# EasyEDA schematic motion sensor2.json
TITLE: Sheet_1; REV: 1.0; Date: 2024-07-08; Sheet: 1/1; Company: Your Company
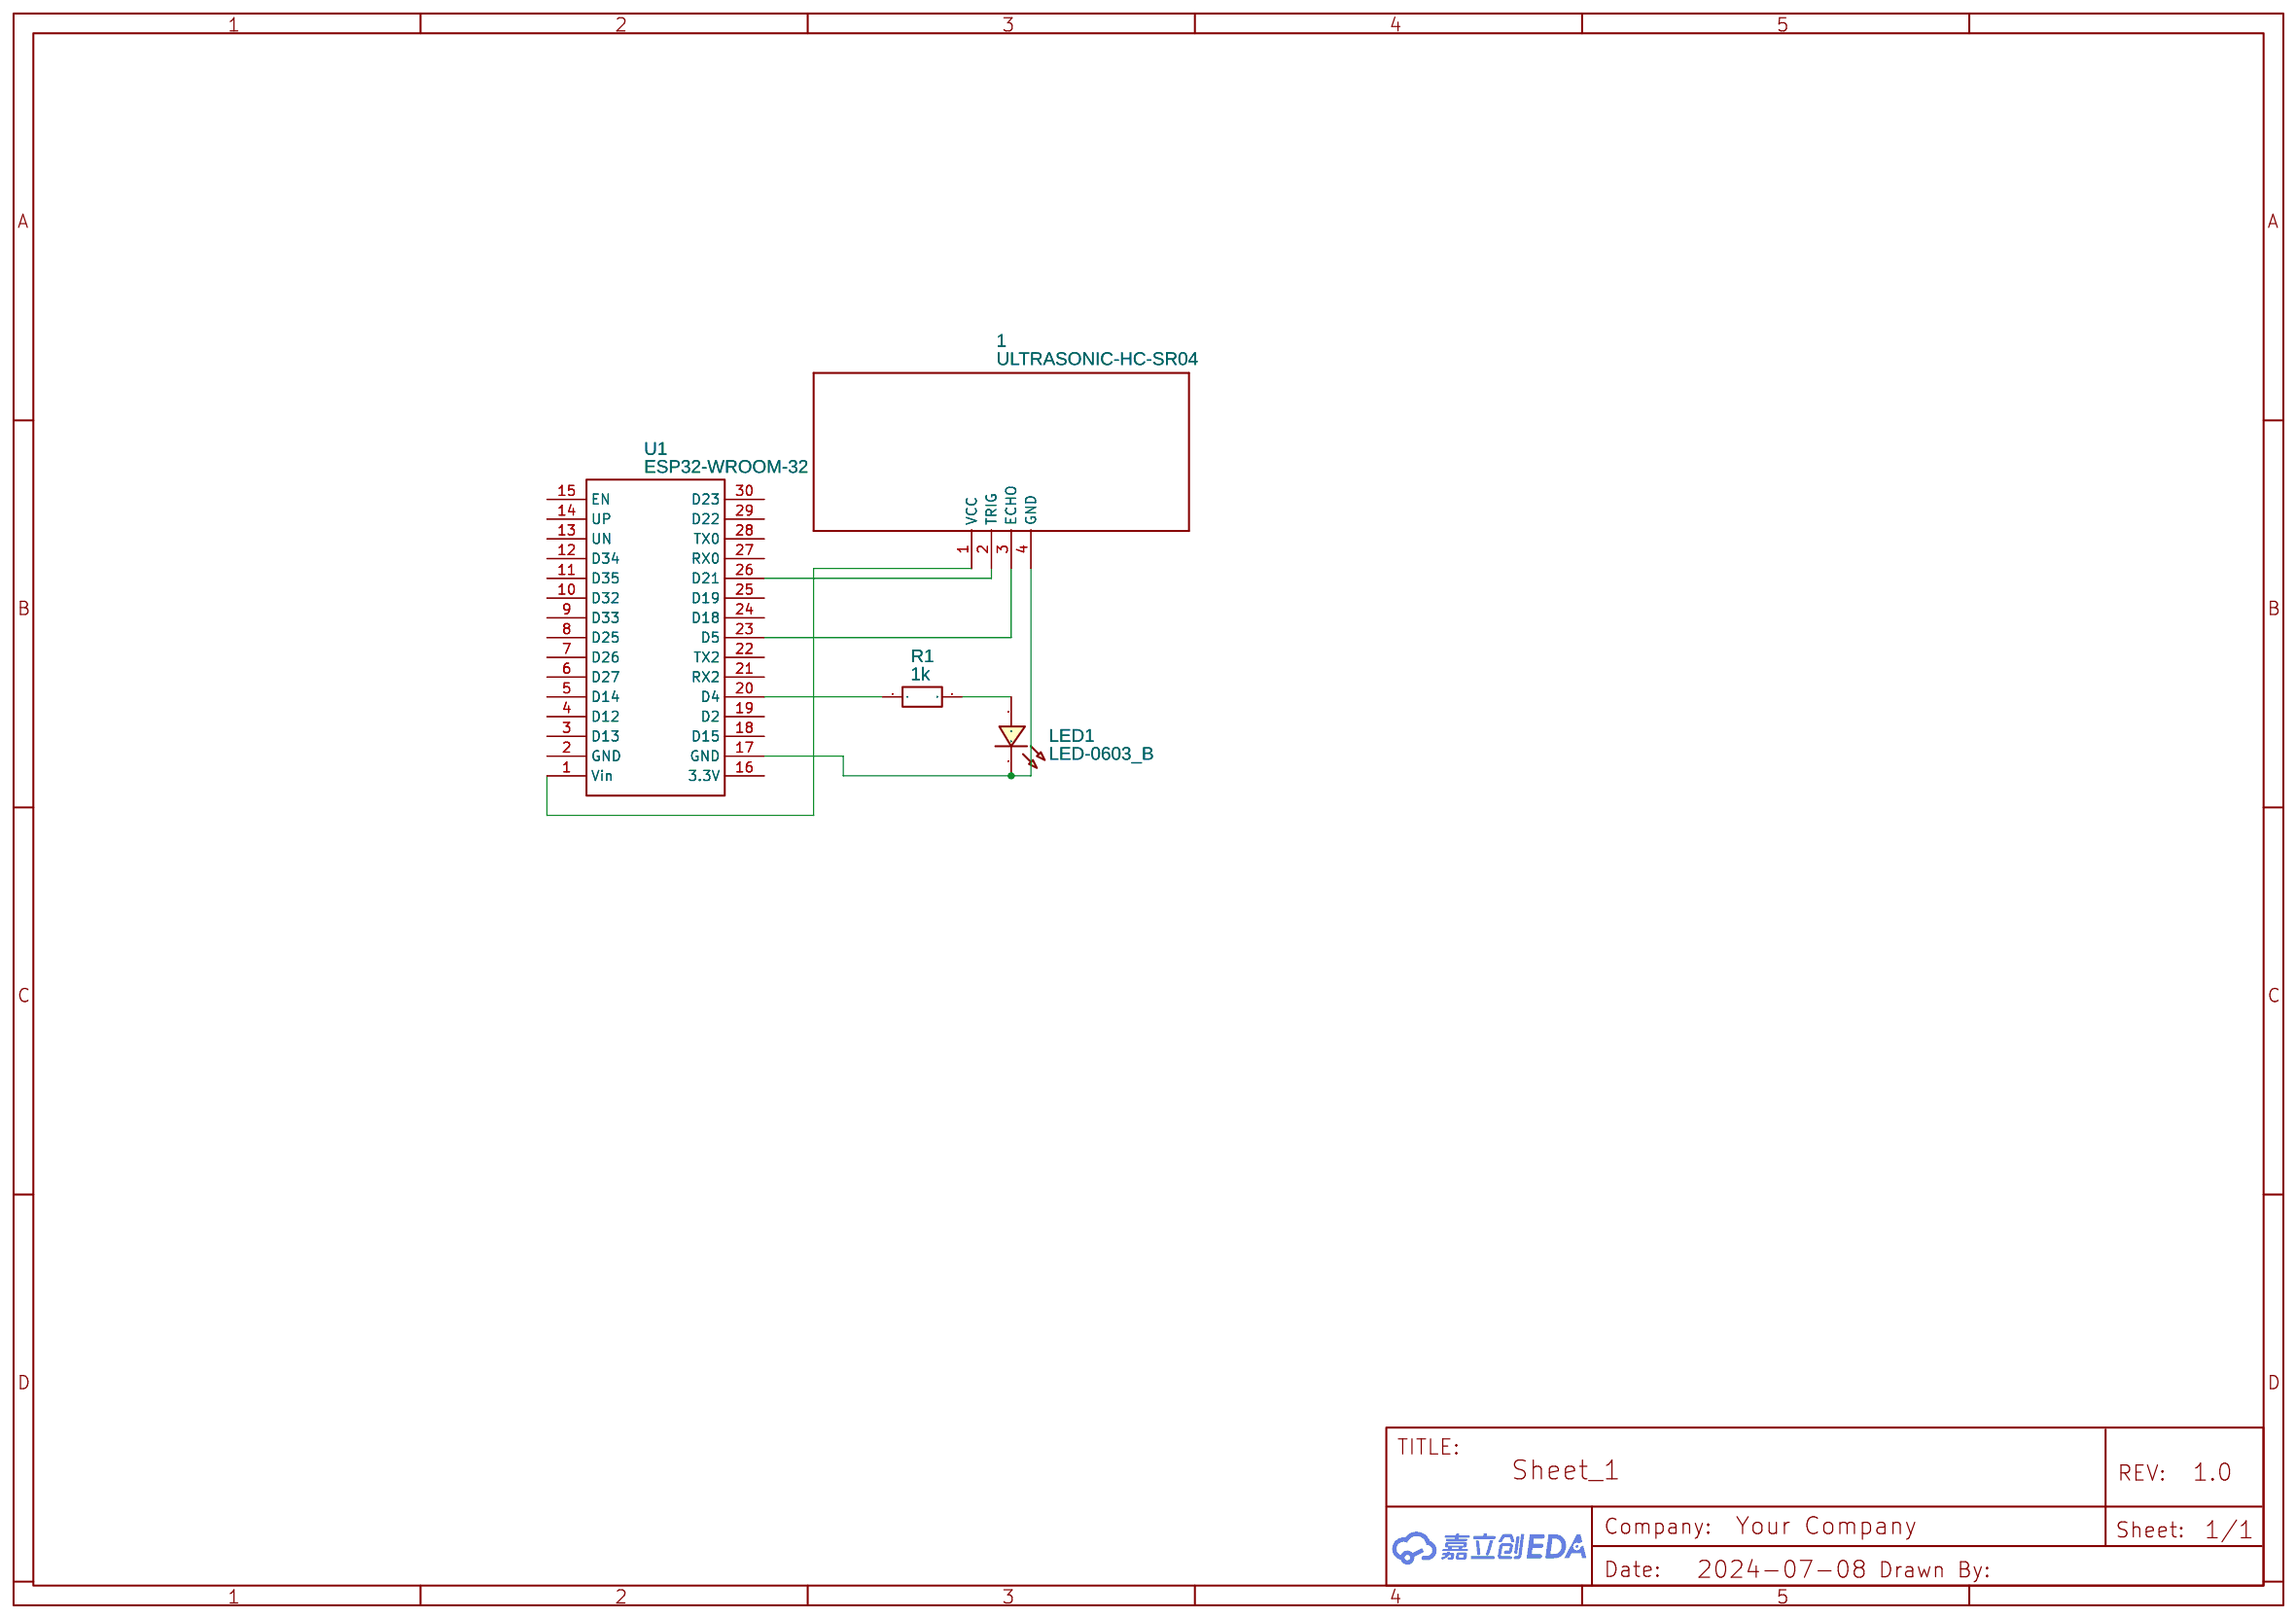
[diagram p0: schematic sheet]

## Parts
1  ULTRASONIC-HC-SR04  [ULTRASONIC-HC-SR04]
LED1  LED-0603_B  [LED0603_BLUE]
R1  1k  [R0603]
U1  ESP32-WROOM-32  [ESP32-WROOM-32]

## Library data of the parts
1 = ULTRASONIC-HC-SR04: Contributor: pawelze
LED1 = LED-0603_B: Manufacturer: EVERLIGHT(台湾亿光); Manufacturer Part: 19-217/BHC-ZL1M2RY/3T; Supplier Part: C72041; Supplier: LCSC; Contributor: LCEDA_01
R1 = R_0603_EU: Contributor: LCEDA_Lib
U1 = ESP32-WROOM-32: Manufacturer: Espressif; Supplier: Espressif; link: https://www.espressif.com/sites/default/files/documentation/esp32_datasheet_en.pdf; Contributor: li_necont

## Nets
Net-(1-1): 1.1(VCC) U1.1(Vin)
Net-(1-2): 1.2(TRIG) U1.26(D21)
Net-(1-3): 1.3(ECHO) U1.23(D5)
Net-(1-4): 1.4(GND) LED1.2 U1.17(GND)
Net-(LED1-1): LED1.1 R1.2
Net-(R1-1): R1.1 U1.20(D4)

Not connected (* = marked no-connect by the designer): U1 2(GND) 3(D13) 4(D12) 5(D14) 6(D27) 7(D26) 8(D25) 9(D33) 10(D32) 11(D35) 12(D34) 13(UN) 14(UP) 15(EN) 16(3.3V) 18(D15) 19(D2) 21(RX2) 22(TX2) 24(D18) 25(D19) 27(RX0) 28(TX0) 29(D22) 30(D23)
